# EAGLE design schema_v2_0 (EAGLE 6.2)
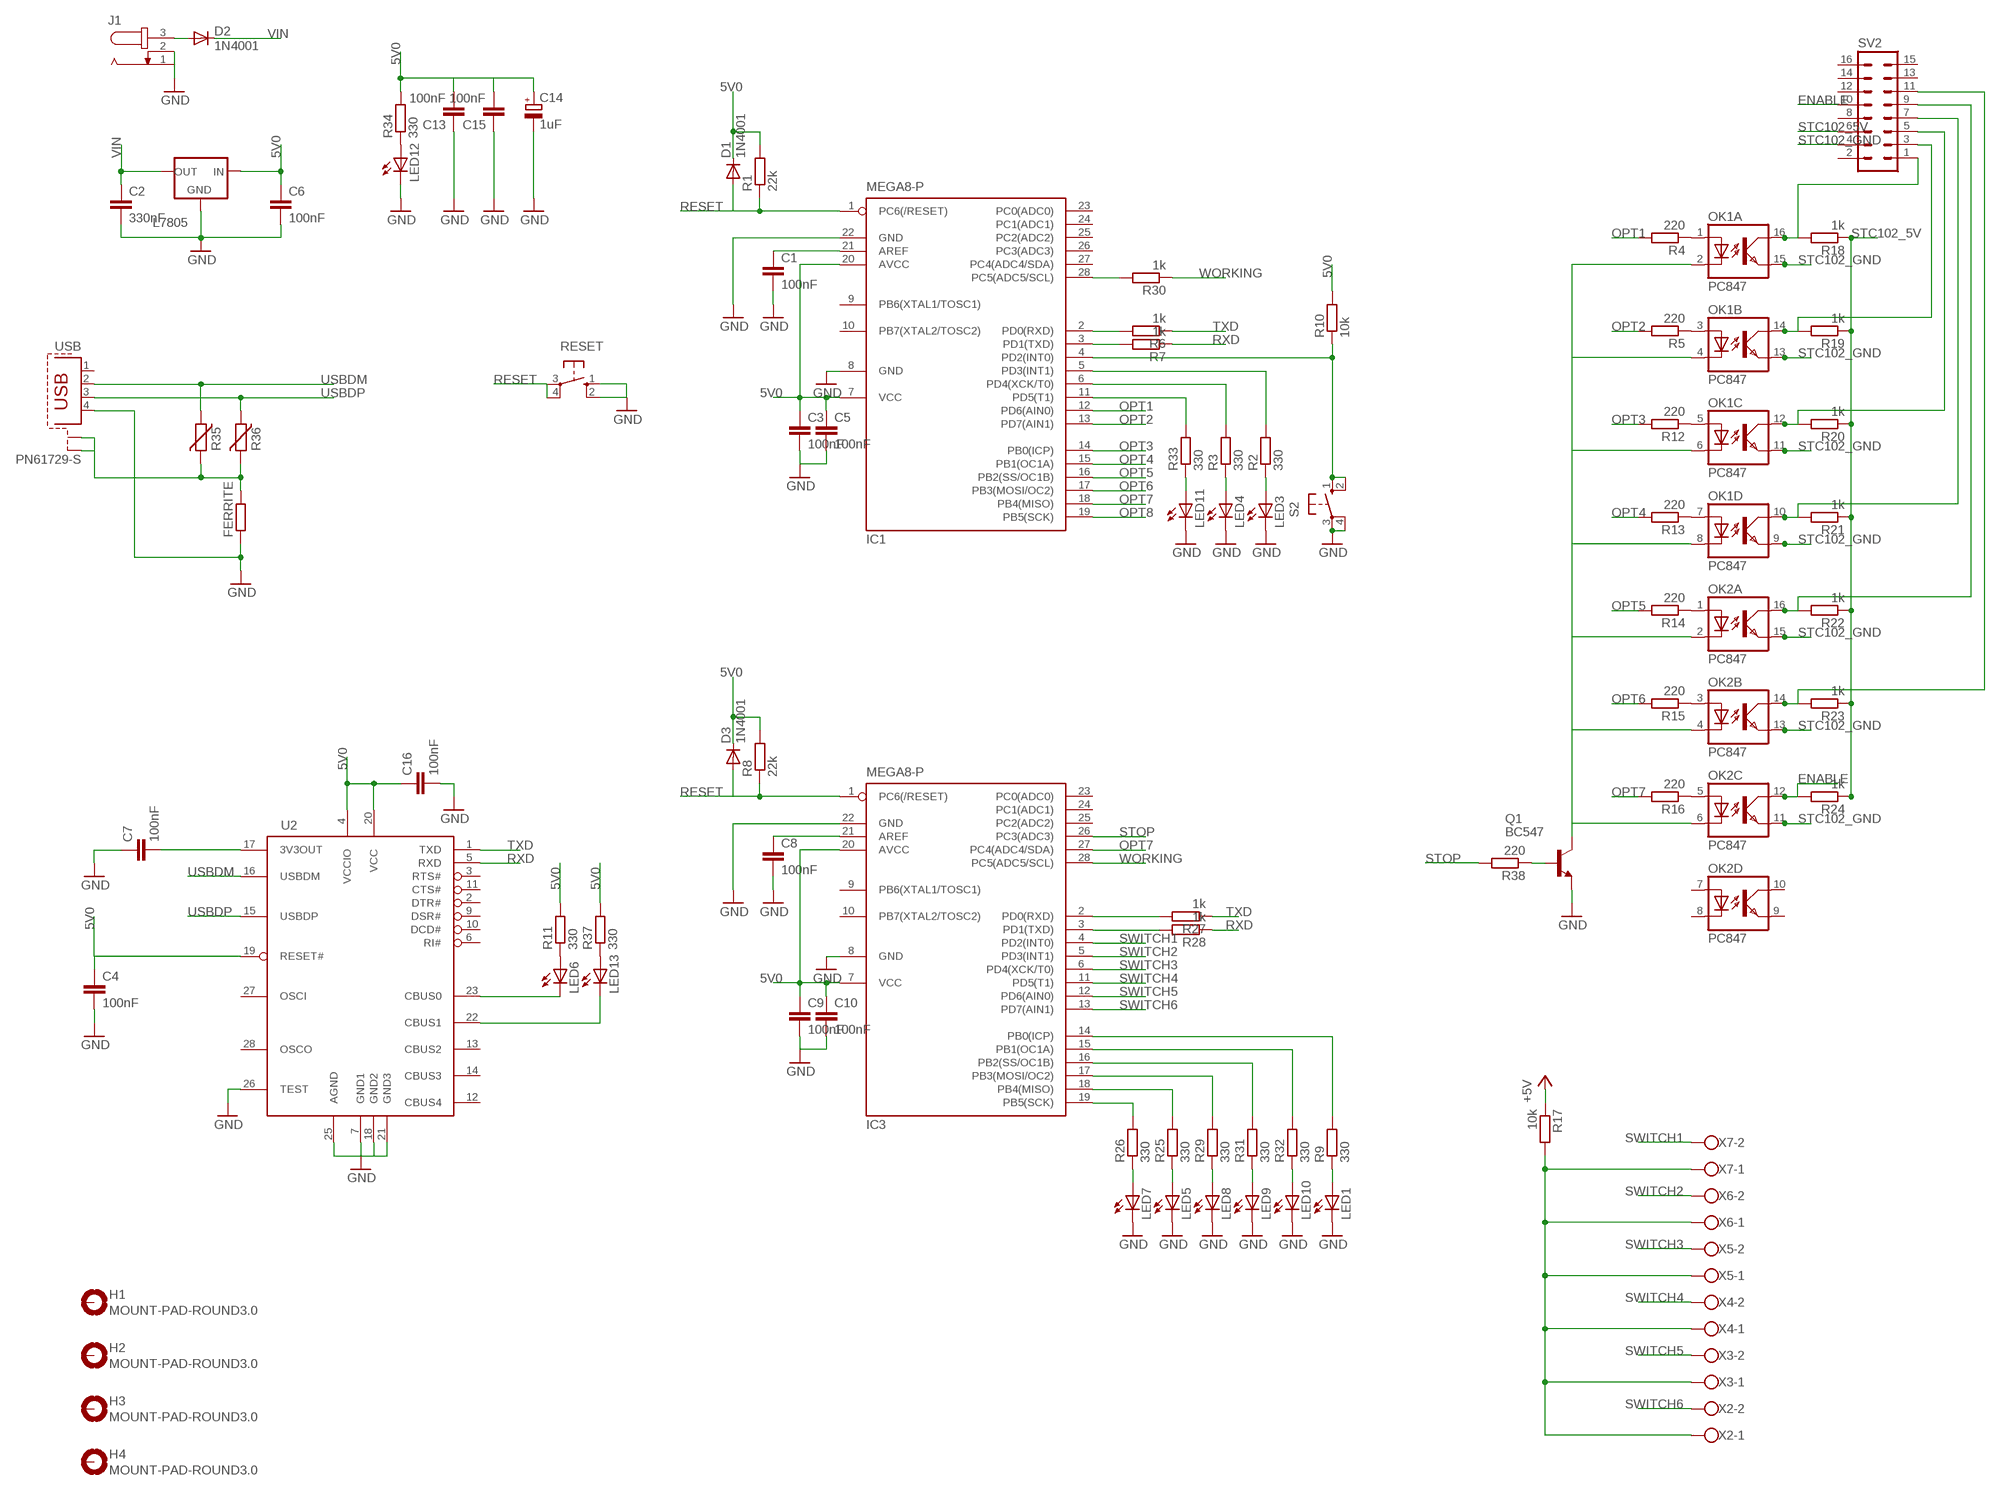
[diagram p0: schematic, sheet 1]

## Parts
C1  100nF  C-EU025-025X050  [C025-025X050]
C2  330nF  C-EU025-025X050  [C025-025X050]
C3  100nF  C-EU025-025X050  [C025-025X050]
C4  100nF  C-EUC0603K  [C0603K]
C5  100nF  C-EU025-025X050  [C025-025X050]
C6  100nF  C-EU025-025X050  [C025-025X050]
C7  100nF  C-EUC0603K  [C0603K]
C8  100nF  C-EU025-025X050  [C025-025X050]
C9  100nF  C-EU025-025X050  [C025-025X050]
C10  100nF  C-EU025-025X050  [C025-025X050]
C13  100nF  C-EU025-025X050  [C025-025X050]
C14  1uF  CPOL-EUE2.5-5  [E2,5-5]
C15  100nF  C-EU025-025X050  [C025-025X050]
C16  100nF  C-EUC0603K  [C0603K]
D1  1N4001  1N4004  [DO41-10]
D2  1N4001  1N4004  [DO41-10]
D3  1N4001  1N4004  [DO41-10]
FERRITE  R-EU_M0805  [M0805]
H1  MOUNT-PAD-ROUND3.0  [3,0-PAD]
H2  MOUNT-PAD-ROUND3.0  [3,0-PAD]
H3  MOUNT-PAD-ROUND3.0  [3,0-PAD]
H4  MOUNT-PAD-ROUND3.0  [3,0-PAD]
IC1  MEGA8-P  [DIL28-3]
IC3  MEGA8-P  [DIL28-3]
J1  JACK-PLUG0  [SPC4077]
L7805  79XXS  [79XXS]
LED1  LED3MM  [LED3MM]
LED3  LED3MM  [LED3MM]
LED4  LED3MM  [LED3MM]
LED5  LED3MM  [LED3MM]
LED6  LED3MM  [LED3MM]
LED7  LED3MM  [LED3MM]
LED8  LED3MM  [LED3MM]
LED9  LED3MM  [LED3MM]
LED10  LED3MM  [LED3MM]
LED11  LED3MM  [LED3MM]
LED12  LED3MM  [LED3MM]
LED13  LED3MM  [LED3MM]
OK1  PC847  [DIL16]
OK2  PC847  [DIL16]
Q1  BC547  [TO92]
R1  22k  R-EU_0207/10  [0207/10]
R2  330  R-EU_0207/10  [0207/10]
R3  330  R-EU_0207/10  [0207/10]
R4  220  R-EU_0207/10  [0207/10]
R5  220  R-EU_0207/10  [0207/10]
R6  1k  R-EU_M1206  [M1206]
R7  1k  R-EU_M1206  [M1206]
R8  22k  R-EU_0207/10  [0207/10]
R9  330  R-EU_0207/10  [0207/10]
R10  10k  R-EU_0207/10  [0207/10]
R11  330  R-EU_0207/10  [0207/10]
R12  220  R-EU_0207/10  [0207/10]
R13  220  R-EU_0207/10  [0207/10]
R14  220  R-EU_0207/10  [0207/10]
R15  220  R-EU_0207/10  [0207/10]
R16  220  R-EU_0207/10  [0207/10]
R17  10k  R-EU_0207/10  [0207/10]
R18  1k  R-EU_0207/10  [0207/10]
R19  1k  R-EU_0207/10  [0207/10]
R20  1k  R-EU_0207/10  [0207/10]
R21  1k  R-EU_0207/10  [0207/10]
R22  1k  R-EU_0207/10  [0207/10]
R23  1k  R-EU_0207/10  [0207/10]
R24  1k  R-EU_0207/10  [0207/10]
R25  330  R-EU_0207/10  [0207/10]
R26  330  R-EU_0207/10  [0207/10]
R27  1k  R-EU_M1206  [M1206]
R28  1k  R-EU_M1206  [M1206]
R29  330  R-EU_0207/10  [0207/10]
R30  1k  R-EU_M1206  [M1206]
R31  330  R-EU_0207/10  [0207/10]
R32  330  R-EU_0207/10  [0207/10]
R33  330  R-EU_0207/10  [0207/10]
R34  330  R-EU_0207/10  [0207/10]
R35  VARISTORCN0603  [CT/CN0603]
R36  VARISTORCN0603  [CT/CN0603]
R37  330  R-EU_0207/10  [0207/10]
R38  220  R-EU_0207/10  [0207/10]
RESET  10-XX  [B3F-10XX]
S2  10-XX  [B3F-10XX]
SV2  MA08-2  [MA08-2]
U2  FT232RL  [SSOP28DB]
USB  PN61729-S  [PN61729-S]
X2  W237-102  [W237-102]
X3  W237-102  [W237-102]
X4  W237-102  [W237-102]
X5  W237-102  [W237-102]
X6  W237-102  [W237-102]
X7  W237-102  [W237-102]

## Nets
5V0: C3.1 C4.1 C5.1 C6.1 C9.1 C10.1 C13.2 C14.+ C15.2 C16.1 D1.C D3.C IC1.7(VCC) IC1.20(AVCC) IC3.7(VCC) IC3.20(AVCC) L7805.IN R1.2 R8.2 R10.2 R11.2 R34.2 R37.2 U2.4(VCCIO) U2.19(RESET#) U2.20(VCC)
+5V: R17.1
ENABLE: OK2.12(C:COL) R24.2 SV2.10
GND: C1.2 C2.2 C3.2 C4.2 C5.2 C6.2 C7.1 C8.2 C9.2 C10.2 C13.1 C14.- C15.1 C16.2 FERRITE.1 IC1.8(GND) IC1.22(GND) IC3.8(GND) IC3.22(GND) J1.1 J1.2 L7805.GND LED1.K(C) LED3.K(C) LED4.K(C) LED5.K(C) LED7.K(C) LED8.K(C) LED9.K(C) LED10.K(C) LED11.K(C) LED12.K(C) Q1.1(E) RESET.1(S) RESET.2(S1) S2.3(P) S2.4(P1) U2.7(GND1) U2.18(GND2) U2.21(GND3) U2.25(AGND) U2.26(TEST) USB.4
N$2: LED1.A R9.1
N$3: C1.1 IC1.21(AREF)
N$4: IC1.6(PD4(XCK/T0)) R3.2
N$5: IC1.4(PD2(INT0)) R10.1 S2.1(S) S2.2(S1)
N$6: LED3.A R2.1
N$7: LED4.A R3.1
N$8: D2.A J1.3
N$9: OK1.16(A:COL) R18.2 SV2.1
N$10: IC1.5(PD3(INT1)) R2.2
N$11: OK1.14(B:COL) R19.2 SV2.3
N$12: OK1.12(C:COL) R20.2 SV2.5
N$13: OK1.10(D:COL) R21.2 SV2.7
N$14: OK2.16(A:COL) R22.2 SV2.9
N$15: OK2.14(B:COL) R23.2 SV2.11
N$16: C8.1 IC3.21(AREF)
N$17: LED6.K(C) U2.23(CBUS0)
N$18: LED13.K(C) U2.22(CBUS1)
N$19: LED6.A R11.1
N$21: IC3.14(PB0(ICP)) R9.2
N$22: IC1.28(PC5(ADC5/SCL)) R30.2
N$23: OK1.2(A:C) OK1.4(B:C) OK1.6(C:C) OK1.8(D:C) OK2.2(A:C) OK2.4(B:C) OK2.6(C:C) Q1.3(C)
N$24: Q1.2(B) R38.1
N$25: IC1.2(PD0(RXD)) R6.2
N$26: IC1.3(PD1(TXD)) R7.2
N$29: OK1.1(A:A) R4.1
N$30: OK1.3(B:A) R5.1
N$31: OK1.5(C:A) R12.1
N$32: OK1.7(D:A) R13.1
N$33: OK2.1(A:A) R14.1
N$34: OK2.3(B:A) R15.1
N$35: OK2.5(C:A) R16.1
N$36: LED5.A R25.1
N$37: R17.2 X2.1 X3.1 X4.1 X5.1 X6.1 X7.1
N$38: LED7.A R26.1
N$39: LED8.A R29.1
N$40: LED10.A R32.1
N$41: IC3.19(PB5(SCK)) R26.2
N$42: LED9.A R31.1
N$43: IC3.2(PD0(RXD)) R27.2
N$44: IC3.3(PD1(TXD)) R28.2
N$45: IC3.18(PB4(MISO)) R25.2
N$46: IC3.17(PB3(MOSI/OC2)) R29.2
N$47: IC3.16(PB2(SS/OC1B)) R31.2
N$48: IC3.15(PB1(OC1A)) R32.2
N$49: LED11.A R33.1
N$50: IC1.11(PD5(T1)) R33.2
N$51: LED12.A R34.1
N$53: FERRITE.2 R35.2 R36.2 USB.S1 USB.S2
N$55: LED13.A R37.1
N$96: C7.2 U2.17(3V3OUT)
OPT1: IC1.12(PD6(AIN0)) R4.2
OPT2: IC1.13(PD7(AIN1)) R5.2
OPT3: IC1.14(PB0(ICP)) R12.2
OPT4: IC1.15(PB1(OC1A)) R13.2
OPT5: IC1.16(PB2(SS/OC1B)) R14.2
OPT6: IC1.17(PB3(MOSI/OC2)) R15.2
OPT7: IC1.18(PB4(MISO)) IC3.27(PC4(ADC4/SDA)) R16.2
OPT8: IC1.19(PB5(SCK))
RESET: D1.A D3.A IC1.1(PC6(/RESET)) IC3.1(PC6(/RESET)) R1.1 R8.1 RESET.3(P) RESET.4(P1)
RXD: R7.1 R28.1 U2.5(RXD)
STC102_5V: R18.1 R19.1 R20.1 R21.1 R22.1 R23.1 R24.1 SV2.6
STC102_GND: OK1.9(D:EMIT) OK1.11(C:EMIT) OK1.13(B:EMIT) OK1.15(A:EMIT) OK2.11(C:EMIT) OK2.13(B:EMIT) OK2.15(A:EMIT) SV2.4
STOP: IC3.26(PC3(ADC3)) R38.2
SWITCH1: IC3.4(PD2(INT0)) X7.2
SWITCH2: IC3.5(PD3(INT1)) X6.2
SWITCH3: IC3.6(PD4(XCK/T0)) X5.2
SWITCH4: IC3.11(PD5(T1)) X4.2
SWITCH5: IC3.12(PD6(AIN0)) X3.2
SWITCH6: IC3.13(PD7(AIN1)) X2.2
TXD: R6.1 R27.1 U2.1(TXD)
USBDM: R35.1 U2.16(USBDM) USB.2
USBDP: R36.1 U2.15(USBDP) USB.3
VIN: C2.1 D2.C L7805.OUT
WORKING: IC3.28(PC5(ADC5/SCL)) R30.1
Unconnected: H1.B3,0(MOUNT) H2.B3,0(MOUNT) H3.B3,0(MOUNT) H4.B3,0(MOUNT) IC1.9(PB6(XTAL1/TOSC1)) IC1.10(PB7(XTAL2/TOSC2)) IC1.23(PC0(ADC0)) IC1.24(PC1(ADC1)) IC1.25(PC2(ADC2)) IC1.26(PC3(ADC3)) IC1.27(PC4(ADC4/SDA)) IC3.9(PB6(XTAL1/TOSC1)) IC3.10(PB7(XTAL2/TOSC2)) IC3.23(PC0(ADC0)) IC3.24(PC1(ADC1)) IC3.25(PC2(ADC2)) OK2.7(D:A) OK2.8(D:C) OK2.9(D:EMIT) OK2.10(D:COL) SV2.2 SV2.8 SV2.12 SV2.13 SV2.14 SV2.15 SV2.16 U2.2(DTR#) U2.3(RTS#) U2.6(RI#) U2.9(DSR#) U2.10(DCD#) U2.11(CTS#) U2.12(CBUS4) U2.13(CBUS2) U2.14(CBUS3) U2.27(OSCI) U2.28(OSCO) USB.1

## Library data of the parts
C1-C10 C13 C15 C16 = rcl:C-EU: CAPACITOR, European symbol
C14 = rcl:CPOL-EU: POLARIZED CAPACITOR, European symbol
D1-D3 = diode:1N4004: DIODE general purpose rectifier, 1 A
FERRITE = resistor:R-EU_: RESISTOR, European symbol
H1-H4 = holes:MOUNT-PAD-ROUND: MOUNTING PAD, round
IC1 IC3 = atmel:MEGA8-P: MICROCONTROLLER 8 Kbytes FLASH, 1 kbytes SRAM, 512 bytes EEPROM, USART, 4-channel 10 bit ADC, 2-channel 8 bit ADC Pin compatible with Atmega48, ATMega88, ATMega168 Source: avr.lbr; OC_FARNELL: unknown; OC_NEWARK: unknown
J1 = con-jack:JACK-PLUG: DC POWER JACK Power Jack, DC, Right Angle, Through Hole, Rated 5A at 16VDC, PC Terminals Distributor: Farnell (www.Farnell.de) Drawing: 84N1161.pdf / 84N1162.pdf Manufacturer: SPC Technology (www.spctechnology.com) Type: SPC4077 / SPC 4078; OC_FARNELL: unknown; OC_NEWARK: unknown
L7805 = v-reg:79XXS: VOLTAGE REGULATOR
LED1 LED3-LED13 = led:LED: LED OSRAM: - CHIPLED LG R971, LG N971, LY N971, LG Q971, LY Q971, LO R971, LY R971 LH N974, LH R974 LS Q976, LO Q976, LY Q976 LO Q996 - Hyper CHIPLED LW Q18S LB Q993, LB Q99A, LB R99A - SideLED LS A670, LO A670, LY A670, LG A670, LP A670 LB A673, LV A673, LT A673, LW A673 LH A674 LY A675 LS A676, LA A676, LO A676, LY A676, LW A676 LS A679, LY A679, LG A679 - Hyper Micro SIDELED® LS Y876, LA Y876, LO Y876, LY Y876 LT Y87S - SmartLED LW L88C, LW L88S LB L89C, LB L89S, LG L890 LS L89K, LO L89K, LY L89K LS L896, LA L896, LO L896, LY L896 - TOPLED LS T670, LO T670, LY T670, LG T670, LP T670 LSG T670, LSP T670, LSY T670, LOP T670, LYG T670 LG T671, LOG T671, LSG T671 LB T673, LV T673, LT T673, LW T673 LH T674 LS T676, LA T676, LO T676, LY T676, LB T676, LH T676, LSB T676, LW T676 LB T67C, LV T67C, LT T67C, LS T67K, LO T67K, LY T67K, LW E67C LS E67B, LA E67B, LO E67B, LY E67B, LB E67C, LV E67C, LT E67C LW T67C LS T679, LY T679, LG T679 LS T770, LO T770, LY T770, LG T770, LP T770 LB T773, LV T773, LT T773, LW T773 LH T774 LS E675, LA E675, LY E675, LS T675 LS T776, LA T776, LO T776, LY T776, LB T776 LHGB T686 LT T68C, LB T68C - Hyper Mini TOPLED® LB M676 - Mini TOPLED Santana® LG M470 LS M47K, LO M47K, LY M47K Source: http://www.osram.convergy.de LUXEON: - LUMILED® LXK2-PW12-R00, LXK2-PW12-S00, LXK2-PW14-U00, LXK2-PW14-V00 LXK2-PM12-R00, LXK2-PM12-S00, LXK2-PM14-U00 LXK2-PE12-Q00, LXK2-PE12-R00, LXK2-PE12-S00, LXK2-PE14-T00, LXK2-PE14-U00 LXK2-PB12-K00, LXK2-PB12-L00, LXK2-PB12-M00, LXK2-PB14-N00, LXK2-PB14-P00, LXK2-PB14-Q00 LXK2-PR12-L00, LXK2-PR12-M00, LXK2-PR14-Q00, LXK2-PR14-R00 LXK2-PD12-Q00, LXK2-PD12-R00, LXK2-PD12-S00 LXK2-PH12-R00, LXK2-PH12-S00 LXK2-PL12-P00, LXK2-PL12-Q00, LXK2-PL12-R00 Source: www.luxeon.com KINGBRIGHT: KA-3528ASYC Source: www.kingbright.com
OK1 OK2 = optocoupler:PC847: SHARP OPTO COUPLER; OC_FARNELL: 9707735; OC_NEWARK: unknown
Q1 = transistor-npn:BC547*: NPN Transistor
R1-R34 R37 R38 = rcl:R-EU_: RESISTOR, European symbol
R35 R36 = varistor:VARISTOR: VARISTOR
RESET S2 = switch-omron:10-XX: OMRON SWITCH; MPN: B3F-1000; OC_FARNELL: 176432; OC_NEWARK: 36M3542
SV2 = con-lstb:MA08-2: PIN HEADER; OC_FARNELL: unknown; OC_NEWARK: unknown
U2 = ftdichip-5:FT232RL: USB UART 4th Generation USB UART (USB <-> Serial) Controller
USB = con-berg:PN61729-S: BERG USB connector; OC_FARNELL: unknown; OC_NEWARK: unknown
X2-X7 = con-wago-500:W237-102: WAGO SCREW CLAMP; MPN: 237-102; OC_FARNELL: unknown; OC_NEWARK: 70K9898

## Net classes
0 default: width 0.203 mm

## Board
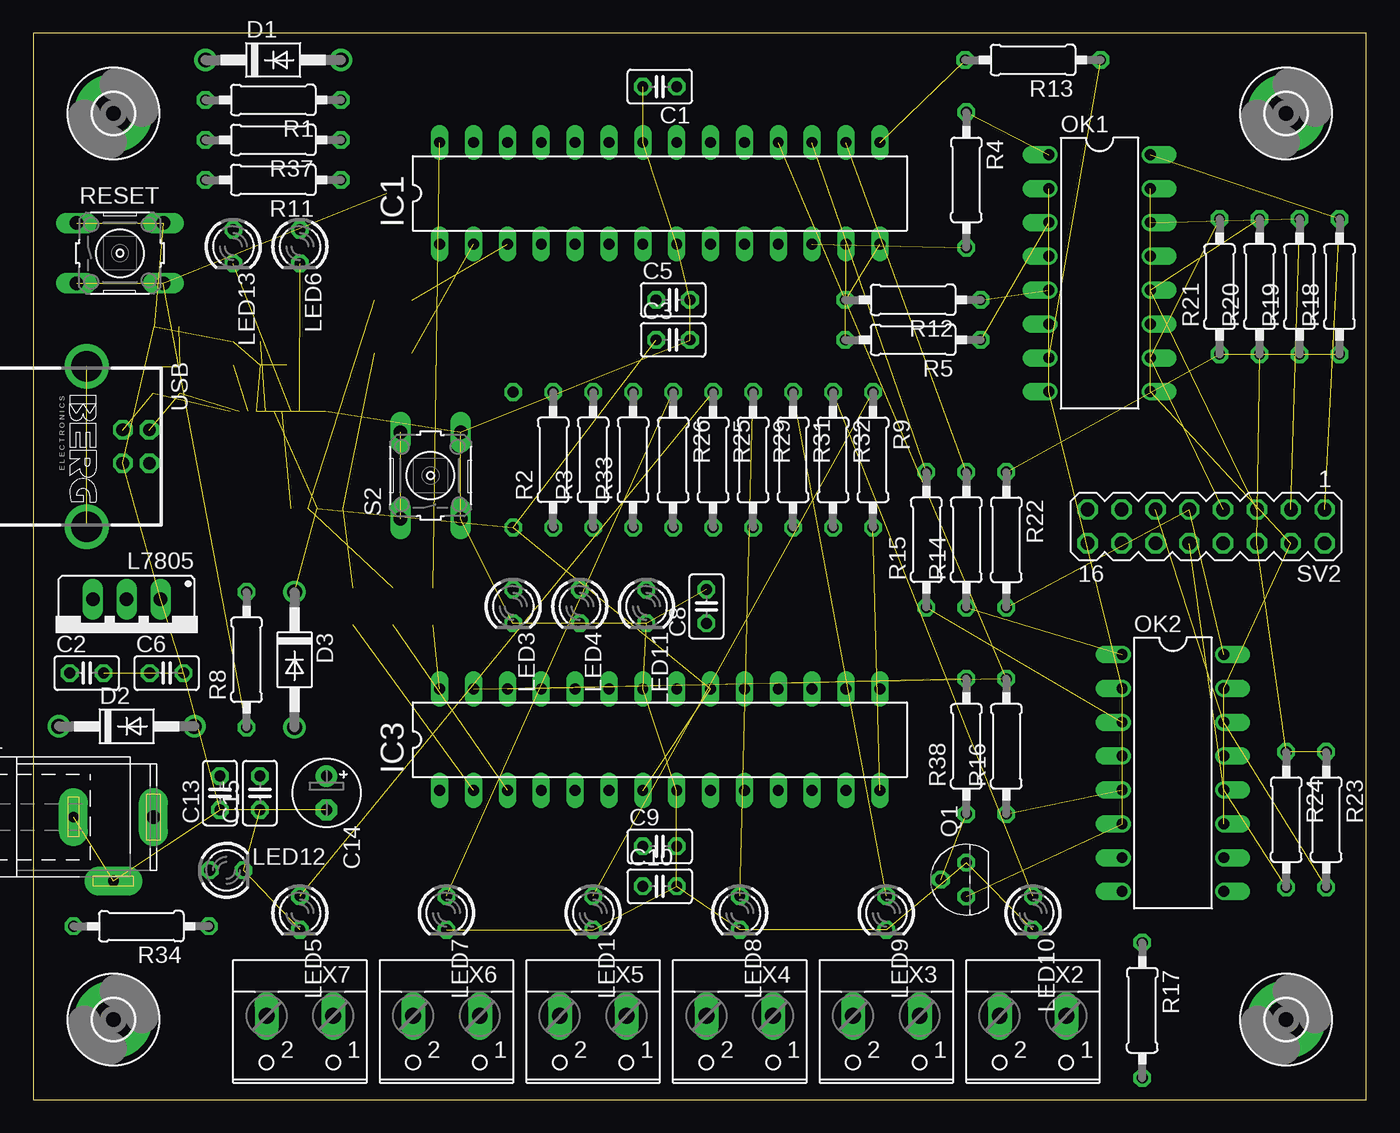
[diagram p1: board, top side]
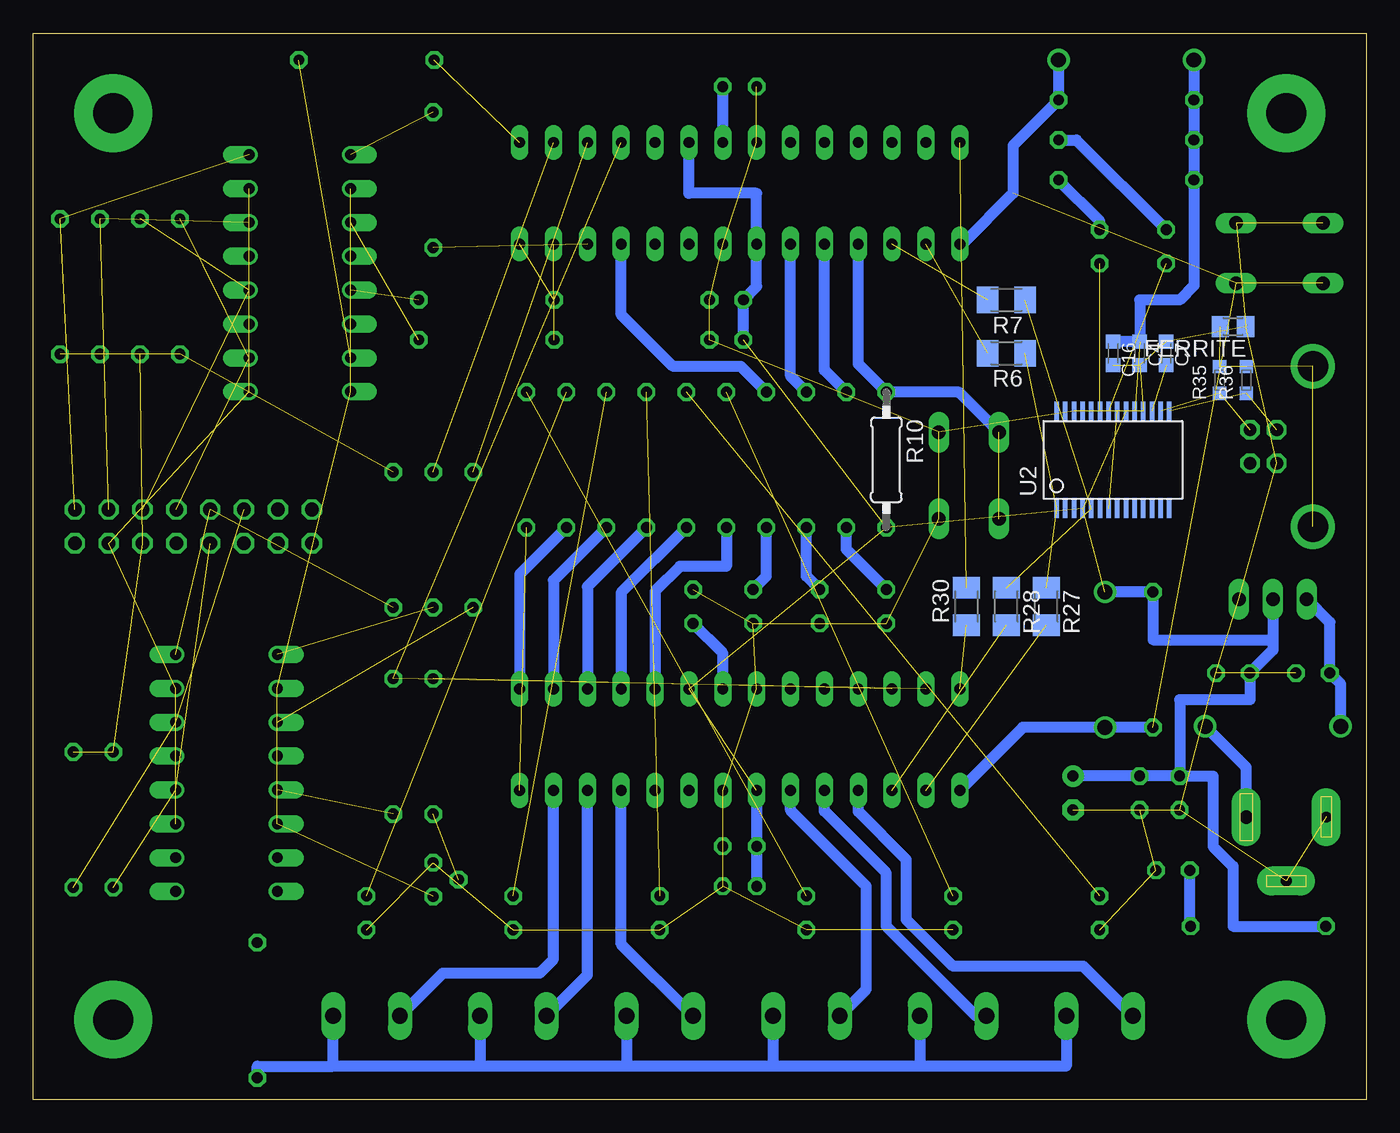
[diagram p2: board, bottom side, seen from below]

Size 100 x 80 mm. Coordinates in mm from the lower left corner, seen from the top.
Outline: 0,0 100,0 100,80 0,80 0,0
Copper layers (1*16): Top 0.035mm / dielectric 1.5mm / Bottom 0.035mm
Design rules: minimum track width 10mil, minimum drill 24mil, track to track 8mil, track to pad 8mil, pad to pad 8mil, via to via 8mil, smd to smd 8mil, copper to edge 40mil, drill to drill 8mil, minimum pad ring 10mil, minimum via ring 8mil, stop-mask expansion 4mil, vias tented up to drill 0mil, thermal gap 10mil

### Footprints (pad centres in the part's own frame; a part is rotated, then mirrored left to right if it is on the bottom)
C025-025X050 = drill 0.813 octagon: 1 -1.27,0; 2 1.27,0
C0603K = smd 1.05 x 1.08: 1 -0.875,0; 2 0.875,0
E2,5-5 = drill 0.813 pad 1.6: + -1.27,0 | drill 0.813 pad 1.6 octagon: - 1.27,0
DO41-10 = drill 1.118: A 5.08,0; C -5.08,0
M0805 = smd 1.3 x 1.6: 1 -0.95,0; 2 0.95,0
3,0-PAD = drill 3 pad 5.842: B3,0 0,0
DIL28-3 = drill 0.813 long: 1 -16.51,-3.81; 2 -13.97,-3.81; 3 -11.43,-3.81; 4 -8.89,-3.81; 5 -6.35,-3.81; 6 -3.81,-3.81; 7 -1.27,-3.81; 8 1.27,-3.81; 9 3.81,-3.81; 10 6.35,-3.81; 11 8.89,-3.81; 12 11.43,-3.81; 13 13.97,-3.81; 14 16.51,-3.81; 15 16.51,3.81; 16 13.97,3.81; 17 11.43,3.81; 18 8.89,3.81; 19 6.35,3.81; 20 3.81,3.81; 21 1.27,3.81; 22 -1.27,3.81; 23 -3.81,3.81; 24 -6.35,3.81; 25 -8.89,3.81; 26 -11.43,3.81; 27 -13.97,3.81; 28 -16.51,3.81
SPC4077 = drill 0.8 pad 2.184 long: 1 -3,0; 2 0,-4.8 | drill 1 pad 2.184 long: 3 3,0
79XXS = drill 1.016 long: GND -2.54,-2.54; IN 0,-2.54; OUT 2.54,-2.54
LED3MM = drill 0.813 octagon: A -1.27,0; K 1.27,0
DIL16 = drill 0.813 offset: 1 -8.89,-3.81; 2 -6.35,-3.81; 3 -3.81,-3.81; 4 -1.27,-3.81; 5 1.27,-3.81; 6 3.81,-3.81; 7 6.35,-3.81; 8 8.89,-3.81; 9 8.89,3.81; 10 6.35,3.81; 11 3.81,3.81; 12 1.27,3.81; 13 -1.27,3.81; 14 -3.81,3.81; 15 -6.35,3.81; 16 -8.89,3.81
TO92 = drill 0.813 octagon: 1 1.27,0; 2 0,1.905; 3 -1.27,0
0207/10 = drill 0.813 octagon: 1 -5.08,0; 2 5.08,0
M1206 = smd 1.6 x 2: 1 -1.4,0; 2 1.4,0
CT/CN0603 = smd 1 x 1: 1 -1,0; 2 1,0
B3F-10XX = drill 1.016 long: 1 -3.251,2.261; 2 3.251,2.261; 3 -3.251,-2.261; 4 3.251,-2.261
MA08-2 = drill 1.016 octagon: 1 -8.89,-1.27; 2 -8.89,1.27; 3 -6.35,-1.27; 4 -6.35,1.27; 5 -3.81,-1.27; 6 -3.81,1.27; 7 -1.27,-1.27; 8 -1.27,1.27; 9 1.27,-1.27; 10 1.27,1.27; 11 3.81,-1.27; 12 3.81,1.27; 13 6.35,-1.27; 14 6.35,1.27; 15 8.89,-1.27; 16 8.89,1.27
SSOP28DB = smd 0.348 x 1.397: 1 -4.225,-3.656; 2 -3.575,-3.656; 3 -2.925,-3.656; 4 -2.275,-3.656; 5 -1.625,-3.656; 6 -0.975,-3.656; 7 -0.325,-3.656; 8 0.325,-3.656; 9 0.975,-3.656; 10 1.625,-3.656; 11 2.275,-3.656; 12 2.925,-3.656; 13 3.575,-3.656; 14 4.225,-3.656; 15 4.225,3.656; 16 3.575,3.656; 17 2.925,3.656; 18 2.275,3.656; 19 1.625,3.656; 20 0.975,3.656; 21 0.325,3.656; 22 -0.325,3.656; 23 -0.975,3.656; 24 -1.625,3.656; 25 -2.275,3.656; 26 -2.925,3.656; 27 -3.575,3.656; 28 -4.225,3.656
PN61729-S = drill 0.95 octagon: 1 1.25,4.71; 2 -1.25,4.71; 3 -1.25,2.71; 4 1.25,2.71 | drill 2.3 pad 2.9: S1 -6.02,0; S2 6.02,0
W237-102 = drill 1.194 long: 1 -2.5,-1.27; 2 2.5,-1.27

### Placement (x,y rotation side)
C1  47,76 180 top
C2  4,32 0 top
C3  48,57 0 top
C4  17,56 270 bottom
C5  48,60 0 top
C6  10,32 0 top
C7  15,56 270 bottom
C8  50.5,37 90 top
C9  47,19 0 top
C10  47,16 0 top
C13  14,23 90 top
C14  22,23 270 top
C15  17,23 90 top
C16  19,56 270 bottom
D1  18,78 0 top
D2  7,28 0 top
D3  19.6,33 270 top
FERRITE  10,58 180 bottom
H1  94,74 0 top
H2  6,74 0 top
H3  6,6 0 top
H4  94,6 0 top
IC1  47,68 0 top
IC3  47,27 0 top
J1  6,21.2 0 top
L7805  7,35 180 top
LED1  42,14 270 top
LED3  36,37 270 top
LED4  41,37 270 top
LED5  20,14 270 top
LED6  20,64 270 top
LED7  31,14 270 top
LED8  53,14 270 top
LED9  64,14 270 top
LED10  75,14 270 top
LED11  46,37 270 top
LED12  14.5,17.2 0 top
LED13  15,64 270 top
OK1  80,62 270 top
OK2  85.5,24.5 270 top
Q1  70,16.5 90 top
R1  18,75 180 top
R2  39,48 90 top
R3  42,48 90 top
R4  70,69 270 top
R5  66,57 180 top
R6  27,56 180 bottom
R7  27,60 180 bottom
R8  16,33 90 top
R9  63,48 270 top
R10  36,48 270 bottom
R11  18,69 180 top
R12  66,60 180 top
R13  75,78 180 top
R14  70,42 90 top
R15  67,42 90 top
R16  73,26.5 90 top
R17  83.2,6.7 270 top
R18  98,61 90 top
R19  95,61 90 top
R20  92,61 90 top
R21  89,61 90 top
R22  73,42 270 top
R23  97,21 270 top
R24  94,21 270 top
R25  51,48 270 top
R26  48,48 270 top
R27  24,37 270 bottom
R28  27,37 270 bottom
R29  54,48 270 top
R30  30,37 90 bottom
R31  57,48 270 top
R32  60,48 270 top
R33  45,48 90 top
R34  8.1,13 180 top
R35  11,54 90 bottom
R36  9,54 90 bottom
R37  18,72 180 top
R38  70,26.5 90 top
RESET  6.5,63.5 0 top
S2  29.8,46.82 90 top
SV2  88,43 180 top
U2  19,48 0 bottom
USB  4,49 270 top
X2  75,5 180 top
X3  64,5 180 top
X4  53,5 180 top
X5  42,5 180 top
X6  31,5 180 top
X7  20,5 180 top

### Tracks (layer width: path | path; a pad name or v marks a point on that pad's centre or on a via)
5V0  (8 unrouted)
  Bottom 0.813: C13.2 C15.2 C14.+ | C13.2 11.5,24.27 11.5,19 10,17.5 10,13 R34.2 | L7805.IN 7,34.5 | 7,34.5 7,33.73 C6.1 8.73,30 14,30 C13.2 | 7,34.5 16,34.5 R8.2 D3.C | IC3.7 C9.1 C10.1 | D1.C R1.2 R37.2 R11.2 12.92,61.08 14,60 17,60 C4.1 C16.1 | C3.1 C5.1 45.73,61 IC1.7 45.73,68 50.81,68 IC1.20
ENABLE  (2 unrouted)
GND  (42 unrouted)
N$2  (1 unrouted)
N$3
  Bottom 0.813: IC1.21 C1.1
N$4
  Bottom 0.813: R3.2 43.19,54.27 IC1.6
N$5  (1 unrouted)
  Bottom 0.813: IC1.4 38.11,55.19 R10.1 30.55,53.08 S2.2
N$6
  Bottom 0.813: LED3.A 39,41.27 R2.1
N$7
  Bottom 0.813: LED4.A 42,39.27 R3.1
N$8
  Bottom 0.813: J1.3 9,24.92 D2.A
N$9  (2 unrouted)
N$10
  Bottom 0.813: R2.2 40.65,54.73 IC1.5
N$11  (2 unrouted)
N$12  (2 unrouted)
N$13  (2 unrouted)
N$14  (2 unrouted)
N$15  (2 unrouted)
N$16
  Bottom 0.813: IC3.21 48.27,33.5 C8.1
N$17  (1 unrouted)
N$18  (1 unrouted)
N$19
  Bottom 0.813: LED6.A 20,65.92 R11.1
N$21  (1 unrouted)
N$22  (1 unrouted)
N$23  (7 unrouted)
N$24  (1 unrouted)
N$25  (1 unrouted)
N$26  (1 unrouted)
N$29  (1 unrouted)
N$30  (1 unrouted)
N$31  (1 unrouted)
N$32  (1 unrouted)
N$33  (1 unrouted)
N$34  (1 unrouted)
N$35  (1 unrouted)
N$36  (1 unrouted)
N$37
  Bottom 0.813: X7.1 22.5,2.5 33.5,2.5 | 33.5,2.5 44.5,2.5 | 44.5,2.5 55.5,2.5 | 55.5,2.5 66.5,2.5 | 66.5,2.5 77.5,2.5 | 77.5,2.5 X2.1 | X6.1 33.5,2.5 | X5.1 44.5,2.5 | X4.1 55.5,2.5 | X3.1 66.5,2.5 | R17.2 83.2,2.5 77.5,2.5
N$38  (1 unrouted)
N$39  (1 unrouted)
N$40  (1 unrouted)
N$41
  Bottom 0.813: R26.2 48,40 51.5,40 53.35,38.15 IC3.19
N$42  (1 unrouted)
N$43  (1 unrouted)
N$44  (1 unrouted)
N$45
  Bottom 0.813: R25.2 55.89,38.03 IC3.18
N$46
  Bottom 0.813: R29.2 58.43,38.49 IC3.17
N$47
  Bottom 0.813: R31.2 60.97,38.95 IC3.16
N$48
  Bottom 0.813: R32.2 63.51,39.41 IC3.15
N$49
  Bottom 0.813: LED11.A 45,39.27 R33.1
N$50
  Bottom 0.813: R33.2 46.92,55 52,55 55.89,58.89 IC1.11
N$51
  Bottom 0.813: R34.1 arc90 13.23,13.05 LED12.A
N$53  (4 unrouted)
N$55
  Bottom 0.813: R37.1 21.73,72 LED13.A
N$96  (1 unrouted)
OPT1  (1 unrouted)
OPT2  (1 unrouted)
OPT3  (1 unrouted)
OPT4  (1 unrouted)
OPT5  (1 unrouted)
OPT6  (1 unrouted)
OPT7  (2 unrouted)
RESET  (3 unrouted)
  Bottom 0.813: R8.1 D3.A 25.76,27.92 IC3.1 | D1.A R1.1 26.5,71.58 26.5,68 30.31,64.19 IC1.1
RXD  (2 unrouted)
STC102_5V  (7 unrouted)
STC102_GND  (7 unrouted)
STOP  (1 unrouted)
SWITCH1
  Bottom 0.813: X7.2 21.23,10 31,10 34.5,13.5 34.5,18 38.11,21.61 IC3.4
SWITCH2
  Bottom 0.813: X6.2 29.27,6.27 36,13 36,17 40.65,21.65 IC3.5
SWITCH3
  Bottom 0.813: X5.2 37.5,8.27 37.5,16 43.19,21.69 IC3.6
SWITCH4
  Bottom 0.813: X4.2 55.89,11.66 IC3.11
SWITCH5
  Bottom 0.813: X3.2 58.43,9.34 IC3.12
SWITCH6
  Bottom 0.813: X2.2 69.27,9.5 62,9.5 60.97,10.53 IC3.13
TXD  (2 unrouted)
USBDM  (2 unrouted)
USBDP  (2 unrouted)
VIN
  Bottom 0.813: D2.C 1.92,31.19 C2.1 2.73,35.81 L7805.OUT
WORKING  (1 unrouted)